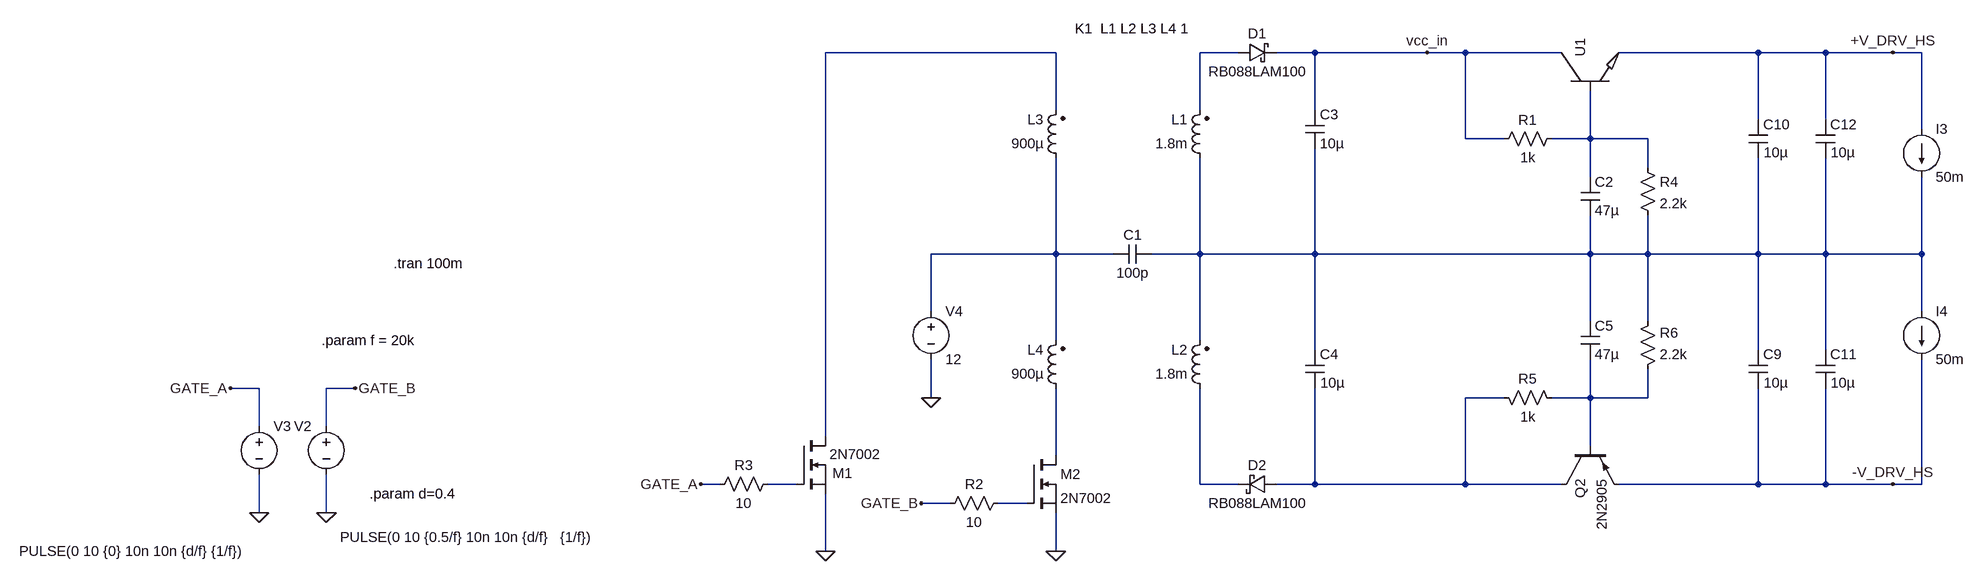
[diagram p0: schematic 100_push_pull.asc]
100_push_pull.asc, the LTspice schematic file:
Version 4
SHEET 1 3240 1404
WIRE 256 -272 -128 -272
WIRE 560 -272 496 -272
WIRE 688 -272 624 -272
WIRE 1040 -272 688 -272
WIRE 1104 -272 1040 -272
WIRE 1264 -272 1104 -272
WIRE 1904 -272 1360 -272
WIRE 2016 -272 1904 -272
WIRE 2128 -272 2016 -272
WIRE 2176 -272 2128 -272
WIRE 256 -176 256 -272
WIRE 496 -176 496 -272
WIRE 688 -176 688 -272
WIRE 1904 -160 1904 -272
WIRE 2016 -160 2016 -272
WIRE 2176 -144 2176 -272
WIRE 1104 -128 1104 -272
WIRE 1168 -128 1104 -128
WIRE 1312 -128 1312 -208
WIRE 1312 -128 1248 -128
WIRE 1408 -128 1312 -128
WIRE 1408 -80 1408 -128
WIRE 1312 -64 1312 -128
WIRE 256 64 256 -96
WIRE 256 64 48 64
WIRE 352 64 256 64
WIRE 496 64 496 -96
WIRE 496 64 416 64
WIRE 688 64 688 -112
WIRE 688 64 496 64
WIRE 1312 64 1312 0
WIRE 1312 64 688 64
WIRE 1408 64 1408 0
WIRE 1408 64 1312 64
WIRE 1904 64 1904 -96
WIRE 1904 64 1408 64
WIRE 2016 64 2016 -96
WIRE 2016 64 1904 64
WIRE 2176 64 2176 -64
WIRE 2176 64 2016 64
WIRE 48 160 48 64
WIRE 2176 160 2176 64
WIRE 1312 176 1312 64
WIRE 1408 176 1408 64
WIRE 256 208 256 64
WIRE 496 208 496 64
WIRE 688 224 688 64
WIRE 1904 224 1904 64
WIRE 2016 224 2016 64
WIRE -1072 288 -1120 288
WIRE -912 288 -960 288
WIRE 48 304 48 240
WIRE 1168 304 1104 304
WIRE 1312 304 1312 240
WIRE 1312 304 1248 304
WIRE 1408 304 1408 256
WIRE 1408 304 1312 304
WIRE -1072 352 -1072 288
WIRE -960 352 -960 288
WIRE -128 368 -128 -272
WIRE 1312 384 1312 304
WIRE 256 400 256 288
WIRE -304 448 -336 448
WIRE -176 448 -224 448
WIRE 496 448 496 288
WIRE 560 448 496 448
WIRE 688 448 688 288
WIRE 688 448 624 448
WIRE 1104 448 1104 304
WIRE 1104 448 688 448
WIRE 1264 448 1104 448
WIRE 1904 448 1904 288
WIRE 1904 448 1360 448
WIRE 2016 448 2016 288
WIRE 2016 448 1904 448
WIRE 2128 448 2016 448
WIRE 2176 448 2176 240
WIRE 2176 448 2128 448
WIRE 80 480 32 480
WIRE 208 480 160 480
WIRE -1072 496 -1072 432
WIRE -960 496 -960 432
WIRE -128 560 -128 464
WIRE 256 560 256 496
FLAG 256 560 0
FLAG -960 496 0
FLAG -912 288 GATE_B
FLAG -1120 288 GATE_A
FLAG 32 480 GATE_B
FLAG -336 448 GATE_A
FLAG 48 304 0
FLAG 2128 448 -V_DRV_HS
FLAG 2128 -272 +V_DRV_HS
FLAG -1072 496 0
FLAG -128 560 0
FLAG 1040 -272 vcc_in
SYMBOL voltage -960 336 M0
WINDOW 123 0 0 Left 0
WINDOW 39 0 0 Left 0
WINDOW 3 -444 201 Left 2
SYMATTR Value PULSE(0 10 {0.5/f} 10n 10n {d/f}   {1/f})
SYMATTR InstName V2
SYMBOL voltage -1072 336 R0
WINDOW 123 0 0 Left 0
WINDOW 39 0 0 Left 0
WINDOW 3 -400 224 Left 2
SYMATTR Value PULSE(0 10 {0} 10n 10n {d/f} {1/f})
SYMATTR InstName V3
SYMBOL voltage 48 144 R0
WINDOW 123 0 0 Left 0
WINDOW 39 0 0 Left 0
SYMATTR InstName V4
SYMATTR Value 12
SYMBOL res 176 464 R90
WINDOW 0 0 56 VBottom 2
WINDOW 3 32 56 VTop 2
SYMATTR InstName R2
SYMATTR Value 10
SYMBOL res -208 432 R90
WINDOW 0 0 56 VBottom 2
WINDOW 3 32 56 VTop 2
SYMATTR InstName R3
SYMATTR Value 10
SYMBOL cap 672 -176 R0
SYMATTR InstName C3
SYMATTR Value 10µ
SYMBOL cap 672 224 R0
WINDOW 3 25 55 Left 2
SYMATTR Value 10µ
SYMATTR InstName C4
SYMBOL nmos -176 368 R0
WINDOW 0 60 62 Left 2
WINDOW 3 55 30 Left 2
SYMATTR InstName M1
SYMATTR Value 2N7002
SYMBOL nmos 208 400 R0
SYMATTR InstName M2
SYMATTR Value 2N7002
SYMBOL cap 1888 224 R0
WINDOW 3 25 55 Left 2
SYMATTR Value 10µ
SYMATTR InstName C9
SYMBOL cap 1888 -160 R0
WINDOW 3 25 55 Left 2
SYMATTR Value 10µ
SYMATTR InstName C10
SYMBOL cap 2000 224 R0
WINDOW 3 25 55 Left 2
SYMATTR Value 10µ
SYMATTR InstName C11
SYMBOL cap 2000 -160 R0
WINDOW 3 25 55 Left 2
SYMATTR Value 10µ
SYMATTR InstName C12
SYMBOL current 2176 -144 R0
WINDOW 123 0 0 Left 0
WINDOW 39 0 0 Left 0
SYMATTR InstName I3
SYMATTR Value 50m
SYMBOL current 2176 160 R0
WINDOW 123 0 0 Left 0
WINDOW 39 0 0 Left 0
SYMATTR InstName I4
SYMATTR Value 50m
SYMBOL ind2 512 -80 R180
WINDOW 0 36 80 Left 2
WINDOW 3 36 40 Left 2
SYMATTR InstName L1
SYMATTR Value 1.8m
SYMATTR Type ind
SYMATTR SpiceLine Rser=0.2
SYMBOL ind2 512 304 R180
WINDOW 0 36 80 Left 2
WINDOW 3 36 40 Left 2
SYMATTR InstName L2
SYMATTR Value 1.8m
SYMATTR Type ind
SYMATTR SpiceLine Rser=0.2
SYMBOL ind2 272 -80 R180
WINDOW 0 36 80 Left 2
WINDOW 3 36 40 Left 2
SYMATTR InstName L3
SYMATTR Value 900µ
SYMATTR Type ind
SYMATTR SpiceLine Rser=0.4
SYMBOL schottky 560 -256 R270
WINDOW 0 32 32 VTop 2
WINDOW 3 0 32 VBottom 2
SYMATTR InstName D1
SYMATTR Value RB088LAM100
SYMATTR Description Diode
SYMATTR Type diode
SYMBOL schottky 624 432 R90
WINDOW 0 0 32 VBottom 2
WINDOW 3 32 32 VTop 2
SYMATTR InstName D2
SYMATTR Value RB088LAM100
SYMATTR Description Diode
SYMATTR Type diode
SYMBOL ind2 272 304 R180
WINDOW 0 36 80 Left 2
WINDOW 3 36 40 Left 2
SYMATTR InstName L4
SYMATTR Value 900µ
SYMATTR Type ind
SYMATTR SpiceLine Rser=0.4
SYMBOL cap 416 48 R90
WINDOW 0 0 32 VBottom 2
WINDOW 3 32 32 VTop 2
SYMATTR InstName C1
SYMATTR Value 100p
SYMBOL res 1264 -144 R90
WINDOW 0 0 56 VBottom 2
WINDOW 3 32 56 VTop 2
SYMATTR InstName R1
SYMATTR Value 1k
SYMBOL cap 1296 -64 R0
SYMATTR InstName C2
SYMATTR Value 47µ
SYMBOL res 1392 -96 R0
SYMATTR InstName R4
SYMATTR Value 2.2k
SYMBOL res 1264 320 M270
WINDOW 0 32 56 VTop 2
WINDOW 3 0 56 VBottom 2
SYMATTR InstName R5
SYMATTR Value 1k
SYMBOL cap 1296 240 M180
WINDOW 0 24 56 Left 2
WINDOW 3 24 8 Left 2
SYMATTR InstName C5
SYMATTR Value 47µ
SYMBOL res 1392 272 M180
WINDOW 0 36 76 Left 2
WINDOW 3 36 40 Left 2
SYMATTR InstName R6
SYMATTR Value 2.2k
SYMBOL pnp 1264 384 M90
SYMATTR InstName Q2
SYMATTR Value 2N2905
SYMBOL bd679 1264 -208 R270
SYMATTR InstName U1
TEXT -848 80 Left 2 !.tran 100m
TEXT 288 -312 Left 2 !K1  L1 L2 L3 L4 1
TEXT -968 208 Left 2 !.param f = 20k
TEXT -888 464 Left 2 !.param d=0.4

The netlist it stands for:
* 100_push_pull.asc
V2 GATE_B 0 PULSE(0 10 {0.5/f} 10n 10n {d/f}   {1/f})
V3 GATE_A 0 PULSE(0 10 {0} 10n 10n {d/f} {1/f})
V4 N004 0 12
R2 N011 GATE_B 10
R3 N009 GATE_A 10
C3 vcc_in N005 10µ
C4 N005 N006 10µ
M1 N001 N009 0 0 2N7002
M2 N008 N011 0 0 2N7002
C9 N005 -V_DRV_HS 10µ
C10 +V_DRV_HS N005 10µ
C11 N005 -V_DRV_HS 10µ
C12 +V_DRV_HS N005 10µ
I3 +V_DRV_HS N005 50m
I4 N005 -V_DRV_HS 50m
L1 N005 N002 1.8m Rser=0.2
L2 N010 N005 1.8m Rser=0.2
L3 N004 N001 900µ Rser=0.4
D1 N002 vcc_in RB088LAM100
D2 N006 N010 RB088LAM100
L4 N008 N004 900µ Rser=0.4
C1 N005 N004 100p
R1 N003 vcc_in 1k
C2 N003 N005 47µ
R4 N003 N005 2.2k
R5 N007 N006 1k
C5 N007 N005 47µ
R6 N007 N005 2.2k
Q2 N006 N007 -V_DRV_HS 0 2N2905
XU1 vcc_in N003 +V_DRV_HS bd679  ; pins C B E
.model D D
.lib standard.dio
.model NPN NPN
.model PNP PNP
.lib standard.bjt
.model NMOS NMOS
.model PMOS PMOS
.lib standard.mos
.tran 100m
K1  L1 L2 L3 L4 1
.param f = 20k
.param d=0.4
.lib BD679.SP3
.backanno
.end